# EAGLE schematic Demo PCB (EAGLE 7.4.0)
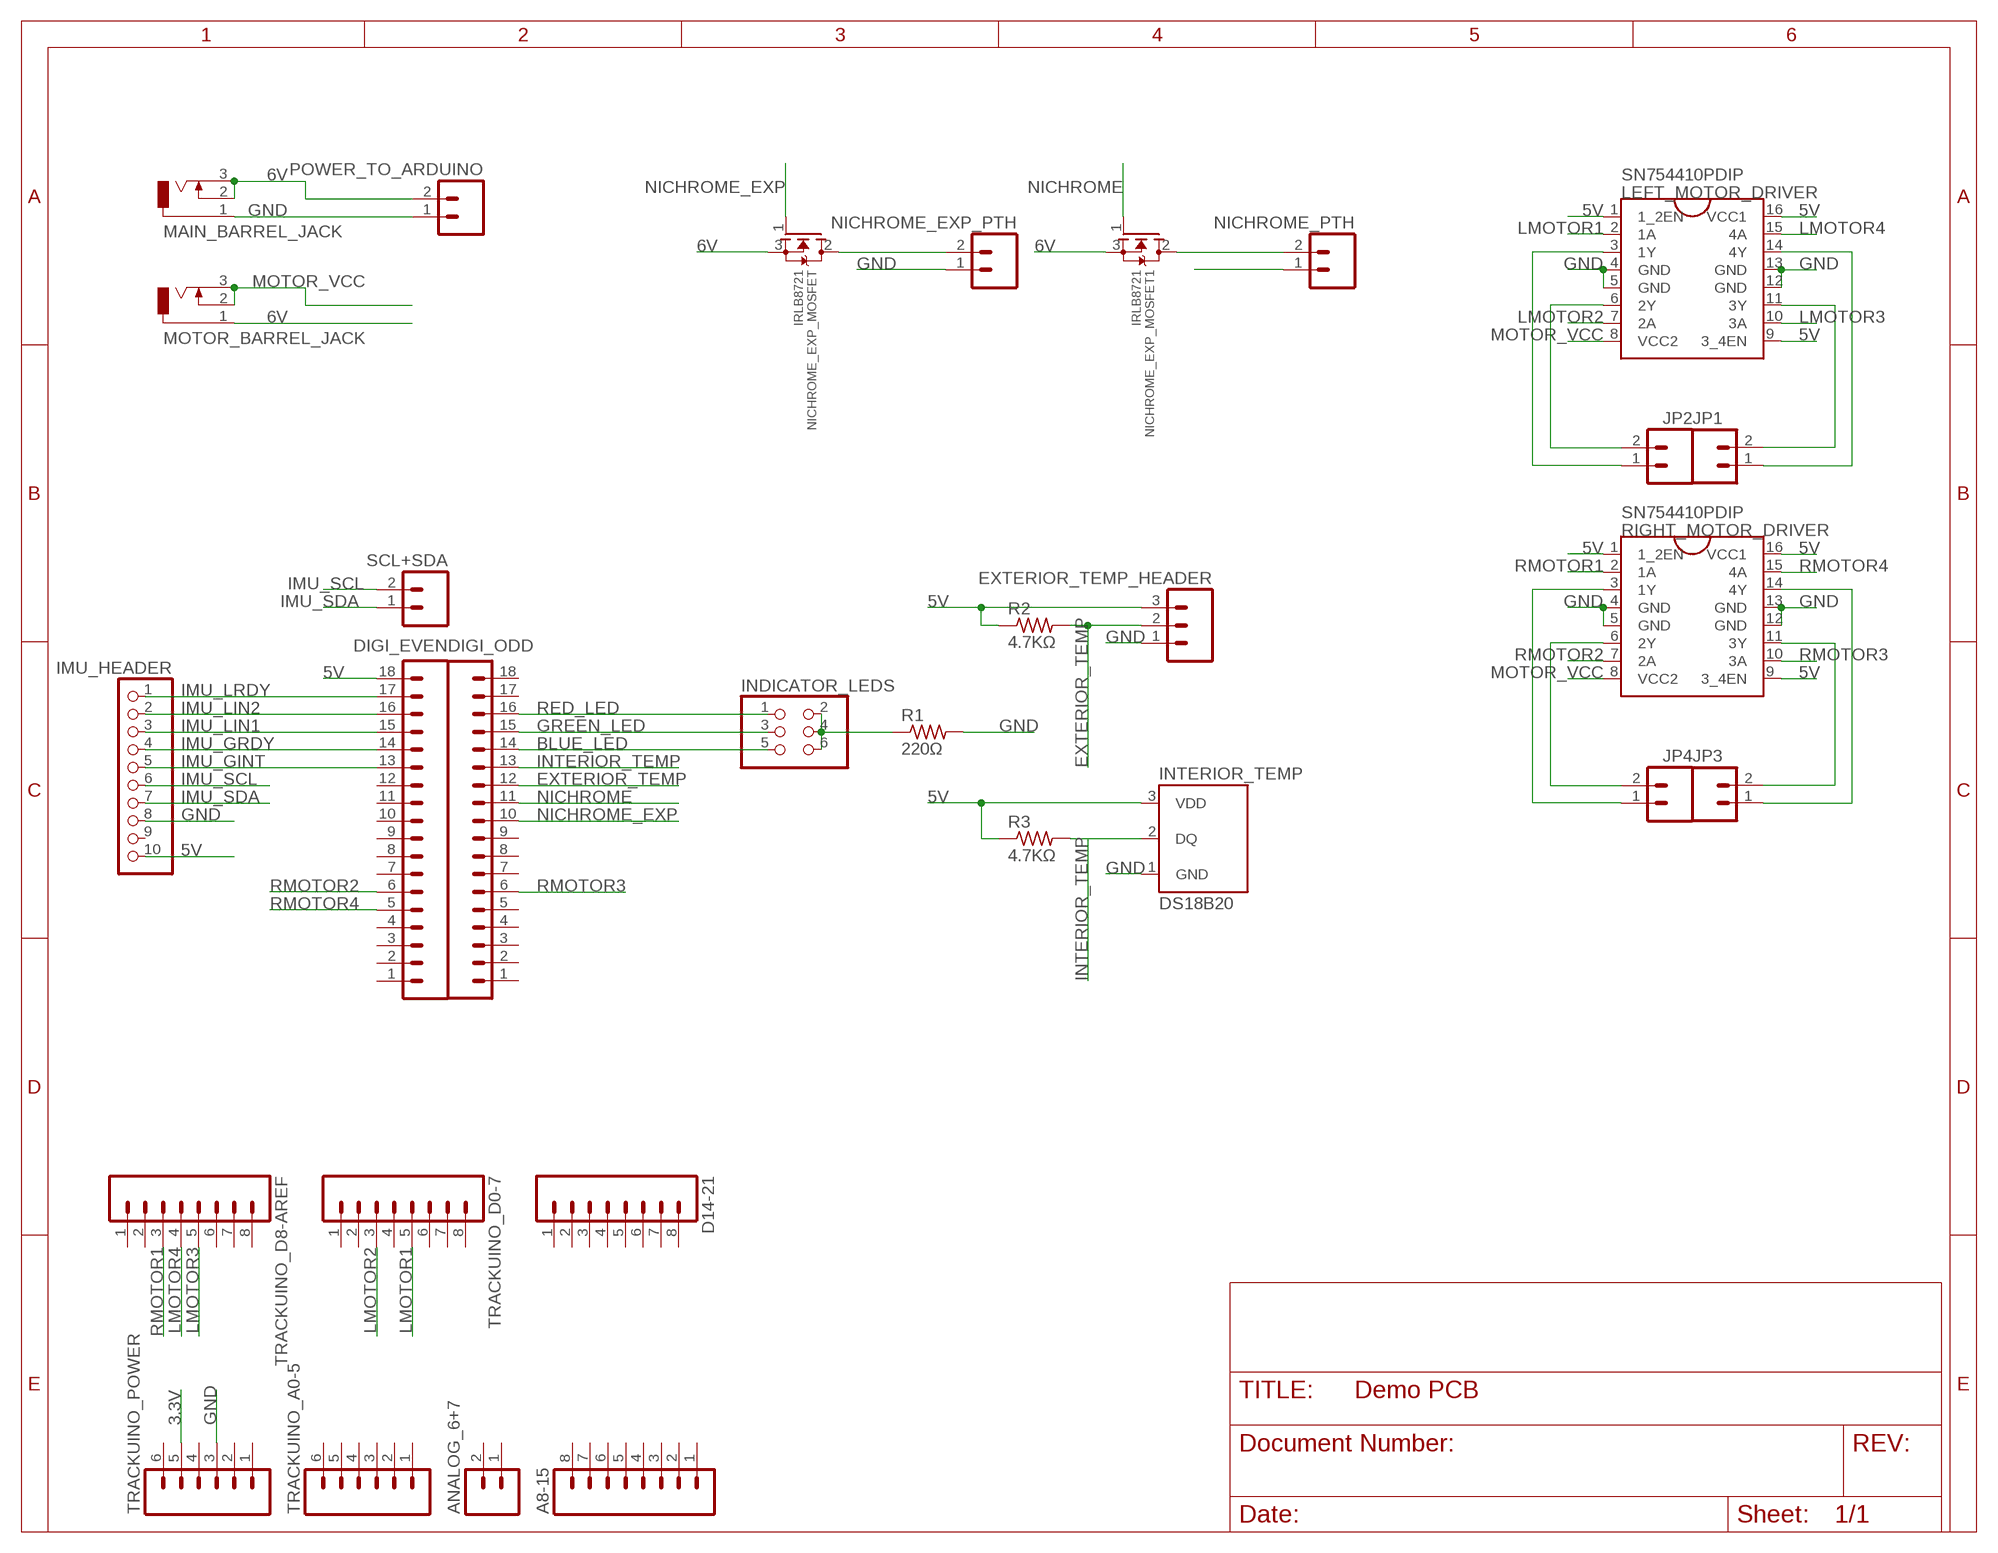
[diagram p0: schematic, sheet 1]

## Parts
A8-15  M08  [1X08_ROUND]
ANALOG_6+7  M02PTH  [1X02]
D14-21  M08  [1X08_ROUND]
DIGI_EVEN  M18_  [1X18]
DIGI_ODD  M18_  [1X18]
EXTERIOR_TEMP_HEADER  M03PTH  [1X03]
IMU_HEADER  PINHD-1X10  [1X10]
INDICATOR_LEDS  PINHD-2X3  [2X03]
INTERIOR_TEMP  DS18B20  [TO-92-AMMO]
JP1  M02PTH  [1X02]
JP2  M02PTH  [1X02]
JP3  M02PTH  [1X02]
JP4  M02PTH  [1X02]
LEFT_MOTOR_DRIVER  SN754410PDIP  [DIL16]
MAIN_BARREL_JACK  DCJ0303  [DCJ0303]
MOTOR_BARREL_JACK  DCJ0303  [DCJ0303]
NICHROME_EXP_MOSFET  IRLB8721  MOSFET-NGDS_TO220V  [TO220V]
NICHROME_EXP_MOSFET1  IRLB8721  MOSFET-NGDS_TO220V  [TO220V]
NICHROME_EXP_PTH  M02PTH  [1X02]
NICHROME_PTH  M02PTH  [1X02]
POWER_TO_ARDUINO  M02PTH  [1X02]
R1  220Ω  R-US_0204/7  [0204/7]
R2  4.7KΩ  R-US_0204/7  [0204/7]
R3  4.7KΩ  R-US_0204/7  [0204/7]
RIGHT_MOTOR_DRIVER  SN754410PDIP  [DIL16]
SCL+SDA  M02PTH  [1X02]
TRACKUINO_A0-5  M06SILK_FEMALE_PTH  [1X06]
TRACKUINO_D0-7  M08  [1X08_ROUND]
TRACKUINO_D8-AREF  M08  [1X08_ROUND]
TRACKUINO_POWER  M06SILK_FEMALE_PTH  [1X06]

## Nets
3.3V: TRACKUINO_POWER.5
5V: DIGI_EVEN.18 EXTERIOR_TEMP_HEADER.3 IMU_HEADER.10 INTERIOR_TEMP.3(VDD) LEFT_MOTOR_DRIVER.1(1_2EN) LEFT_MOTOR_DRIVER.9(3_4EN) LEFT_MOTOR_DRIVER.16(VCC1) R2.1 R3.1 RIGHT_MOTOR_DRIVER.1(1_2EN) RIGHT_MOTOR_DRIVER.9(3_4EN) RIGHT_MOTOR_DRIVER.16(VCC1)
6V: MAIN_BARREL_JACK.2 MAIN_BARREL_JACK.3 MOTOR_BARREL_JACK.1 NICHROME_EXP_MOSFET1.3(S) NICHROME_EXP_MOSFET.3(S) POWER_TO_ARDUINO.2
BLUE_LED: DIGI_ODD.14 INDICATOR_LEDS.5
EXTERIOR_TEMP: DIGI_ODD.12 EXTERIOR_TEMP_HEADER.2 R2.2
GND: EXTERIOR_TEMP_HEADER.1 IMU_HEADER.8 INTERIOR_TEMP.1(GND) LEFT_MOTOR_DRIVER.4(GND) LEFT_MOTOR_DRIVER.5(GND) LEFT_MOTOR_DRIVER.12(GND) LEFT_MOTOR_DRIVER.13(GND) MAIN_BARREL_JACK.1 NICHROME_EXP_PTH.1 NICHROME_PTH.1 POWER_TO_ARDUINO.1 R1.2 RIGHT_MOTOR_DRIVER.4(GND) RIGHT_MOTOR_DRIVER.5(GND) RIGHT_MOTOR_DRIVER.12(GND) RIGHT_MOTOR_DRIVER.13(GND) TRACKUINO_POWER.3
GREEN_LED: DIGI_ODD.15 INDICATOR_LEDS.3
IMU_GINT: DIGI_EVEN.13 IMU_HEADER.5
IMU_GRDY: DIGI_EVEN.14 IMU_HEADER.4
IMU_LIN1: DIGI_EVEN.15 IMU_HEADER.3
IMU_LIN2: DIGI_EVEN.16 IMU_HEADER.2
IMU_LRDY: DIGI_EVEN.17 IMU_HEADER.1
IMU_SCL: IMU_HEADER.6 SCL+SDA.2
IMU_SDA: IMU_HEADER.7 SCL+SDA.1
INTERIOR_TEMP: DIGI_ODD.13
LMOTOR1: LEFT_MOTOR_DRIVER.2(1A) TRACKUINO_D0-7.5
LMOTOR2: LEFT_MOTOR_DRIVER.7(2A) TRACKUINO_D0-7.3
LMOTOR3: LEFT_MOTOR_DRIVER.10(3A) TRACKUINO_D8-AREF.5
LMOTOR4: LEFT_MOTOR_DRIVER.15(4A) TRACKUINO_D8-AREF.4
MOTOR_VCC: LEFT_MOTOR_DRIVER.8(VCC2) MOTOR_BARREL_JACK.2 MOTOR_BARREL_JACK.3 RIGHT_MOTOR_DRIVER.8(VCC2)
N$1: INTERIOR_TEMP.2(DQ) R3.2
N$2: NICHROME_EXP_MOSFET1.2(D) NICHROME_EXP_MOSFET.2(D) NICHROME_EXP_PTH.2 NICHROME_PTH.2
N$3: JP1.2 LEFT_MOTOR_DRIVER.11(3Y)
N$4: JP1.1 LEFT_MOTOR_DRIVER.14(4Y)
N$5: INDICATOR_LEDS.2 INDICATOR_LEDS.4 INDICATOR_LEDS.6 R1.1
N$6: JP2.2 LEFT_MOTOR_DRIVER.6(2Y)
N$7: JP2.1 LEFT_MOTOR_DRIVER.3(1Y)
N$8: JP3.2 RIGHT_MOTOR_DRIVER.11(3Y)
N$9: JP3.1 RIGHT_MOTOR_DRIVER.14(4Y)
N$10: JP4.2 RIGHT_MOTOR_DRIVER.6(2Y)
N$11: JP4.1 RIGHT_MOTOR_DRIVER.3(1Y)
NICHROME: DIGI_ODD.11 NICHROME_EXP_MOSFET1.1(G)
NICHROME_EXP: DIGI_ODD.10 NICHROME_EXP_MOSFET.1(G)
RED_LED: DIGI_ODD.16 INDICATOR_LEDS.1
RMOTOR1: RIGHT_MOTOR_DRIVER.2(1A) TRACKUINO_D8-AREF.3
RMOTOR2: DIGI_EVEN.6 RIGHT_MOTOR_DRIVER.7(2A)
RMOTOR3: DIGI_ODD.6 RIGHT_MOTOR_DRIVER.10(3A)
RMOTOR4: DIGI_EVEN.5 RIGHT_MOTOR_DRIVER.15(4A)
Unconnected: A8-15.1 A8-15.2 A8-15.3 A8-15.4 A8-15.5 A8-15.6 A8-15.7 A8-15.8 ANALOG_6+7.1 ANALOG_6+7.2 D14-21.1 D14-21.2 D14-21.3 D14-21.4 D14-21.5 D14-21.6 D14-21.7 D14-21.8 DIGI_EVEN.1 DIGI_EVEN.2 DIGI_EVEN.3 DIGI_EVEN.4 DIGI_EVEN.7 DIGI_EVEN.8 DIGI_EVEN.9 DIGI_EVEN.10 DIGI_EVEN.11 DIGI_EVEN.12 DIGI_ODD.1 DIGI_ODD.2 DIGI_ODD.3 DIGI_ODD.4 DIGI_ODD.5 DIGI_ODD.7 DIGI_ODD.8 DIGI_ODD.9 DIGI_ODD.17 DIGI_ODD.18 IMU_HEADER.9 TRACKUINO_A0-5.1 TRACKUINO_A0-5.2 TRACKUINO_A0-5.3 TRACKUINO_A0-5.4 TRACKUINO_A0-5.5 TRACKUINO_A0-5.6 TRACKUINO_D0-7.1 TRACKUINO_D0-7.2 TRACKUINO_D0-7.4 TRACKUINO_D0-7.6 TRACKUINO_D0-7.7 TRACKUINO_D0-7.8 TRACKUINO_D8-AREF.1 TRACKUINO_D8-AREF.2 TRACKUINO_D8-AREF.6 TRACKUINO_D8-AREF.7 TRACKUINO_D8-AREF.8 TRACKUINO_POWER.1 TRACKUINO_POWER.2 TRACKUINO_POWER.4 TRACKUINO_POWER.6

## Library data of the parts
A8-15 D14-21 TRACKUINO_D0-7 TRACKUINO_D8-AREF = SparkFun-Connectors:M08: Header 8 Standard 8-pin 0.1" header. Use with straight break away headers (SKU : PRT-00116), right angle break away headers (PRT-00553), swiss pins (PRT-00743), machine pins (PRT-00117), and female headers (PRT-00115).
ANALOG_6+7 JP1-JP4 NICHROME_EXP_PTH NICHROME_PTH POWER_TO_ARDUINO SCL+SDA = SparkFun-Connectors:M02: Standard 2-pin 0.1" header. Use with - straight break away headers ( PRT-00116) - right angle break away headers (PRT-00553) - swiss pins (PRT-00743) - machine pins (PRT-00117) - female headers (PRT-00115) Molex polarized connector foot print use with: PRT-08233 with associated crimp pins and housings. 2.54_SCREWTERM for use with PRT-10571. 3.5mm Screw Terminal footprints for PRT-08084 5mm Screw Terminal footprints for use with PRT-08432
DIGI_EVEN DIGI_ODD = SparkFun-Connectors:M18: 1x18 .1" header
EXTERIOR_TEMP_HEADER = SparkFun-Connectors:M03: Header 3 Standard 3-pin 0.1" header. Use with straight break away headers (SKU : PRT-00116), right angle break away headers (PRT-00553), swiss pins (PRT-00743), machine pins (PRT-00117), and female headers (PRT-00115). Molex polarized connector foot print use with SKU : PRT-08232 with associated crimp pins and housings.
IMU_HEADER = pinhead:PINHD-1X10: PIN HEADER
INDICATOR_LEDS = pinhead:PINHD-2X3: PIN HEADER
INTERIOR_TEMP = SparkFun-Sensors:DS18B20: Dallas/Maxim DS18B20 1-wire temperature sensor Datasheet: http://datasheets.maximintegrated.com/en/ds/DS18B20.pdf temp thermometer 1-wire one-wire one wire; STORE_ID: SEN-00245
LEFT_MOTOR_DRIVER RIGHT_MOTOR_DRIVER = AlexW-Eagle-Libraries:SN754410
MAIN_BARREL_JACK MOTOR_BARREL_JACK = con-jack:DCJ0303: DC POWER JACK Source: DCJ0303.pdf; OC_FARNELL: unknown; OC_NEWARK: unknown
NICHROME_EXP_MOSFET NICHROME_EXP_MOSFET1 = adafruit:MOSFET-N: N-Channel Mosfet 2N7002E - 60V 260mA SOT23 [Digikey: 2N7002ET1GOSTR-ND] - REEL BSH103 - 30V 850mA SOT23 [Digikey: 568-5013-1-ND]
R1-R3 = resistor:R-US_: RESISTOR, American symbol
TRACKUINO_A0-5 TRACKUINO_POWER = SparkFun-Connectors:M06: Header 6 Standard 6-pin 0.1" header. Use with straight break away headers (SKU : PRT-00116), right angle break away headers (PRT-00553), swiss pins (PRT-00743), machine pins (PRT-00117), and female headers (PRT-00115). Molex polarized connector foot print use with SKU : PRT-08094 with associated crimp pins and housings. NOTES ON THE VARIANTS LOCK and LOCK_LONGPADS... This footprint was designed to help hold the alignment of a through-hole component (i.e. 6-pin header) while soldering it into place. You may notice that each hole has been shifted either up or down by 0.005 of an inch from it's more standard position (which is a perfectly straight line). This slight alteration caused the pins (the squares in the middle) to touch the edges of the holes. Because they are alternating, it causes a "brace" to hold the component in place. 0.005 has proven to be the perfect amount of "off-center" position when using our standard breakaway headers. Although looks a little odd when you look at the bare footprint, once you have a header in there, the alteration is very hard to notice. Also,if you push a header all the way into place, it is covered up entirely on the bottom side. This idea of altering the position of holes to aid alignment will be further integrated into the Sparkfun Library for other footprints. It can help hold any component with 3 or more connection pins.; PROD_ID: CONN-08437